# EasyEDA Pro project 贴片练习PCB.epro, schematic Schematic1
Create Date: 2023-04-28; Page Name: P2; Project Name: 贴贴板; Schematic Name: Schematic1; Update Date: 2023-04-28; Company: 嘉立创EDA; Page Size: A4; Version: V1.0
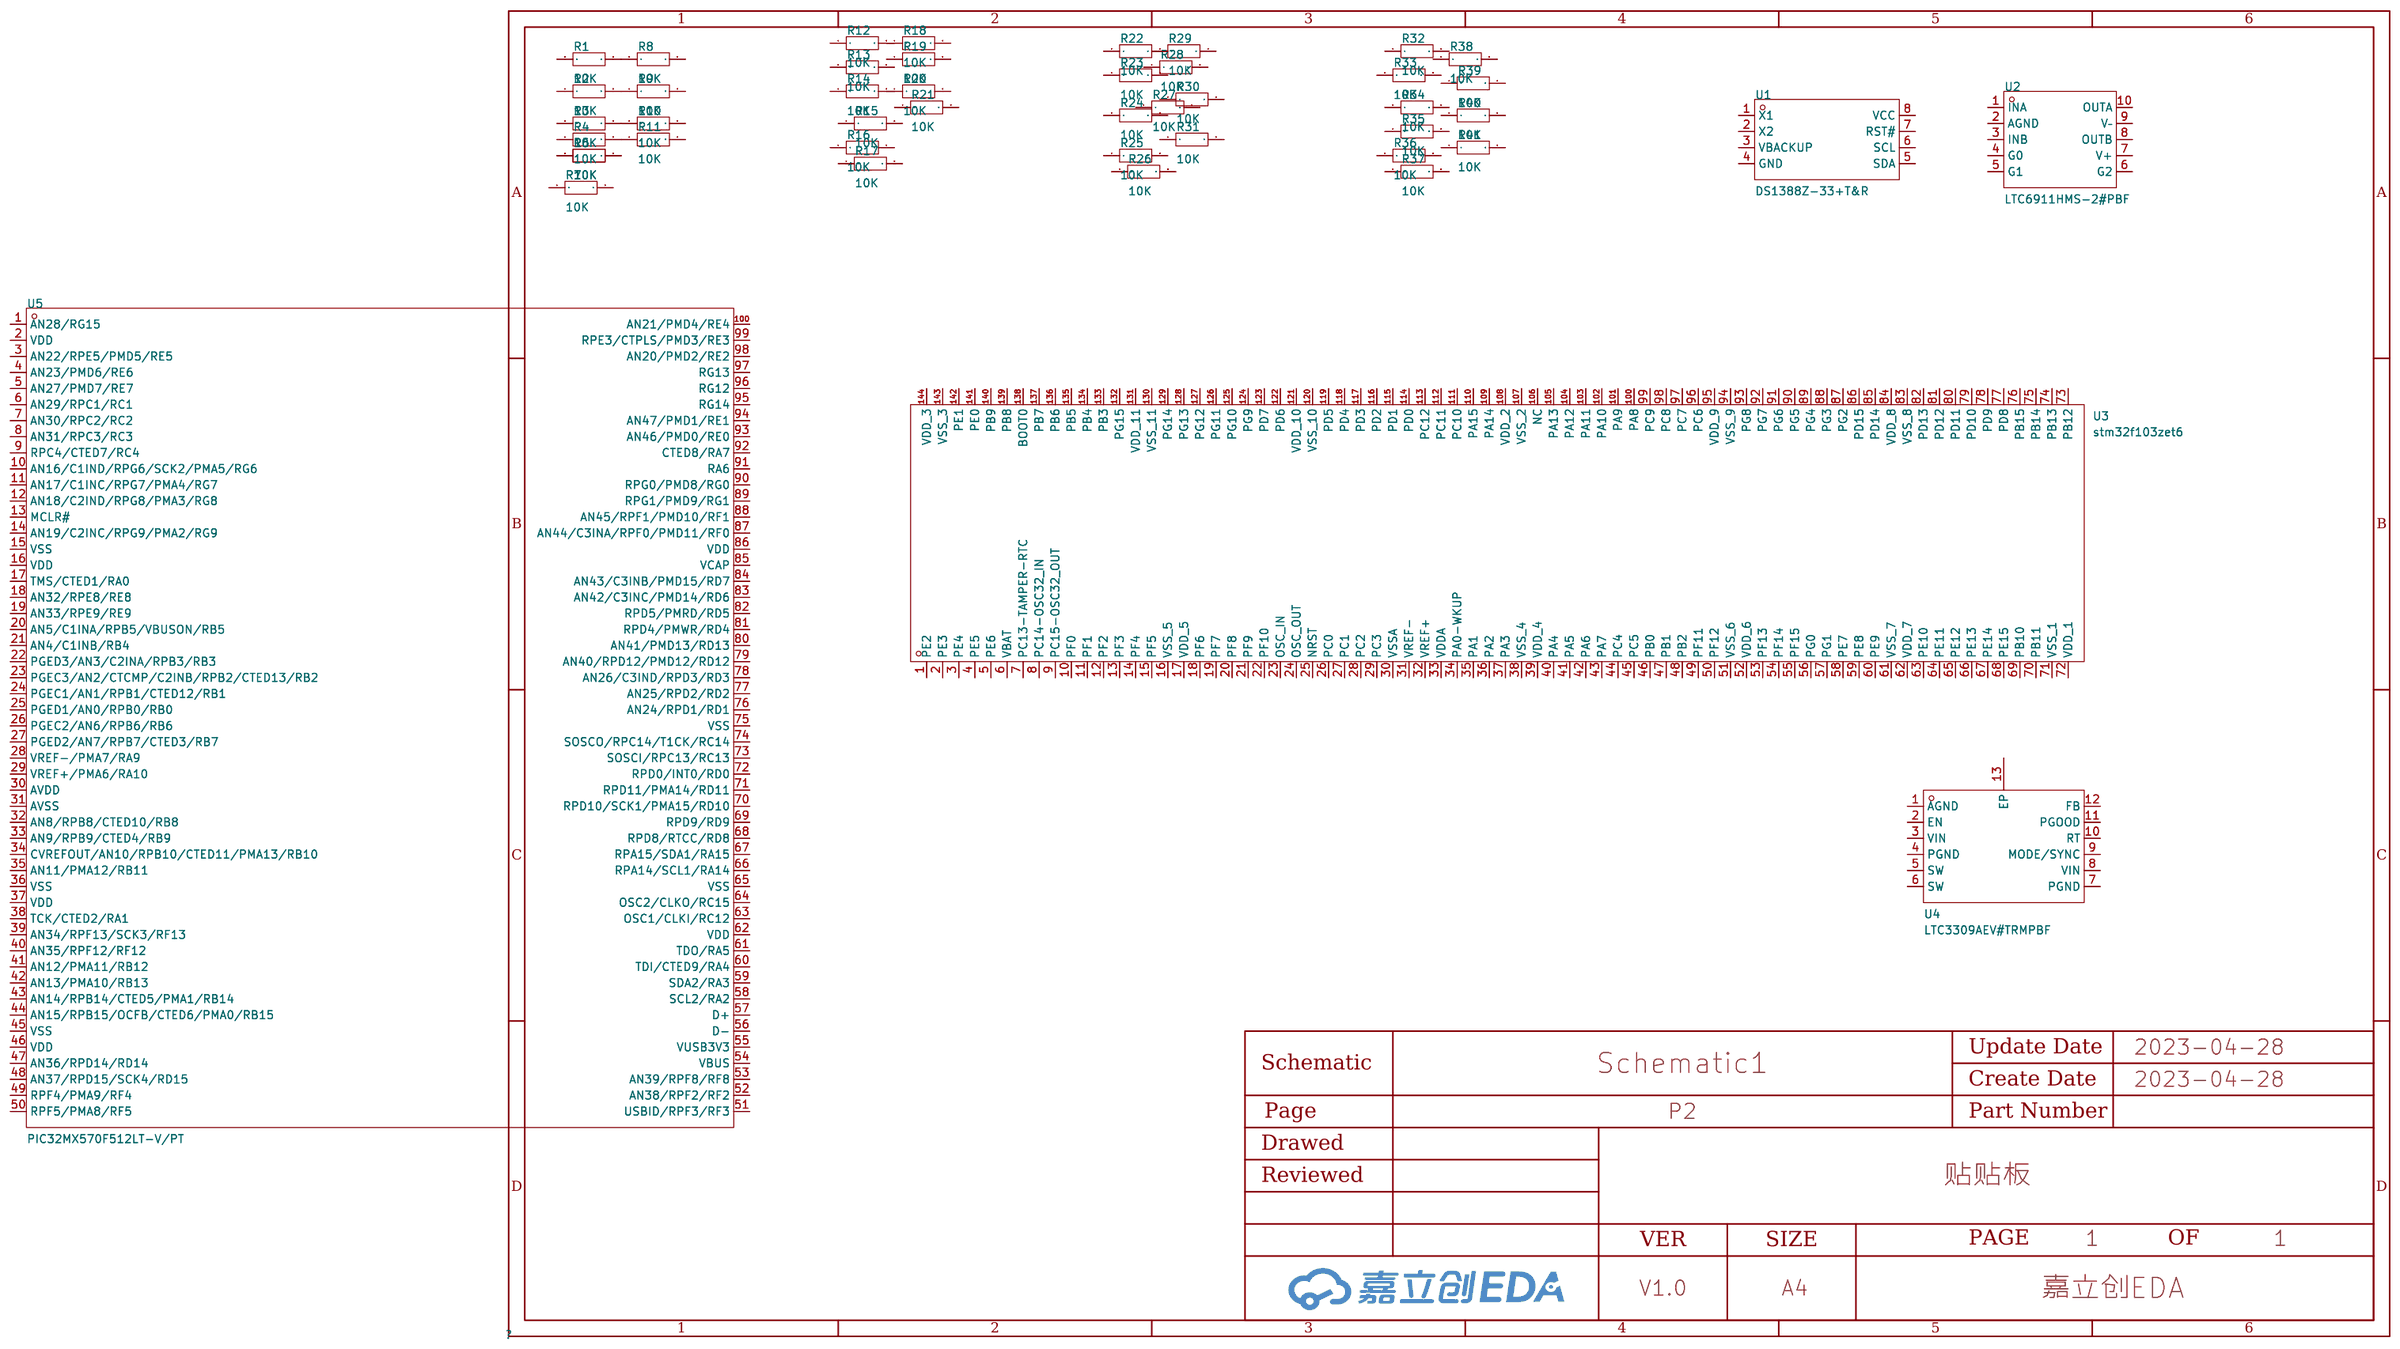
[diagram p0: schematic sheet]

## Parts
R1  10K  [R0201]
R2  10K  [R0201]
R3  10K  [R0201]
R4  10K  [R0201]
R5  10K  [R0201]
R6  10K  [R0201]
R7  10K  [R0201]
R8  10K  [R0201]
R9  10K  [R0201]
R10  10K  [R0201]
R11  10K  [R0201]
R12  10K  [R0402]
R13  10K  [R0402]
R14  10K  [R0402]
R15  10K  [R0402]
R16  10K  [R0402]
R17  10K  [R0402]
R18  10K  [R0402]
R19  10K  [R0402]
R20  10K  [R0402]
R21  10K  [R0402]
R22  10K  [R0603]
R23  10K  [R0603]
R24  10K  [R0603]
R25  10K  [R0603]
R26  10K  [R0603]
R27  10K  [R0603]
R28  10K  [R0603]
R29  10K  [R0603]
R30  10K  [R0603]
R31  10K  [R0603]
R32  10K  [R0805]
R33  10K  [R0805]
R34  10K  [R0805]
R35  10K  [R0805]
R36  10K  [R0805]
R37  10K  [R0805]
R38  10K  [R0805]
R39  10K  [R0805]
R40  10K  [R0805]
R41  10K  [R0805]
U1  DS1388Z-33+T&R  [SOIC-8_L4.9-W3.9-P1.27-LS6.0-BL]
U2  LTC6911HMS-2#PBF  [MSOP-10_L3.0-W3.0-P0.50-LS4.9-BL]
U3  stm32f103zet6  [LQFP-144_L20.0-W20.0-P0.50-LS22.0-BL]
U4  LTC3309AEV#TRMPBF  [LQFN-12_L2.0-W2.0-P0.50-TL-EP0.7]
U5  PIC32MX570F512LT-V/PT  [TQFP-100_L12.0-W12.0-P0.40-LS14.0-BL]

## Library data of the parts
R1-R11 = Res_0201: Supplier Footprint: 0201
R12-R21 = Res_0402: Supplier Footprint: 0402
R22-R31 = Res_0603: Supplier Footprint: 0603
R32-R41 = Res_0805: Supplier Footprint: 0805
U1 = DS1388Z-33+T&R: 接口:I2C;; LCSC Part Name: I2C 2.97V~3.63V; Supplier Part: C118483; Manufacturer: ADI(亚德诺)/MAXIM(美信); Supplier Footprint: SOIC-8; JLCPCB Part Class: Extended Part; Datasheet: https://atta.szlcsc.com/upload/public/pdf/source/20170713/C118483_1499918892954816767.pdf; Supplier: LCSC; Interface: I2C; Operating Voltage: 2.97V~3.63V
U2 = LTC6911HMS-2#PBF: 放大器类型:-;通道数:2;-3dB带宽:-;输入偏置电流(Ib):-;压摆率(SR):16V/us;; Supplier Part: C689693; Manufacturer: ADI(亚德诺); Supplier Footprint: MSOP-10; JLCPCB Part Class: Extended Part; Datasheet: https://atta.szlcsc.com/upload/public/pdf/source/20200728/C689697_D29A73EDDD2648B90A1111EA674FAD07.pdf; Supplier: LCSC; Number of Channels: 2; Slew Rate (SR): 16V/us; Supply Current: 3.1mA
U3 = stm32f103zet6_1: Supplier Part: C9900046927; Supplier Footprint: LQFP-100; Supplier: LCSC
U4 = LTC3309AEV#TRMPBF: 功能类型:降压型;同步整流:是;输出类型:可调;输出通道数:1;拓扑结构:降压式;输入电压:2.25V~5.5V;输出电压:500mV~2.25V;输出电流(最大值):6A;开关频率:3MHz;工作温度:-40℃~+125℃@(TJ);; LCSC Part Name: 降压型 Vin=2.25V~5.5V Vout=500mV~2.25V 6A; Supplier Part: C684456; Manufacturer: ADI(亚德诺)/LINEAR(凌特); Supplier Footprint: LQFN-12; JLCPCB Part Class: Extended Part; Datasheet: https://atta.szlcsc.com/upload/public/pdf/source/20200727/C684456_2EC784DF8DBB6B6CF85BFFE81950187B.pdf; Supplier: LCSC; Function: 降压型; Synchronous Rectification: 是; Output Type: 可调; Number of Outputs: 1; Topology: 降压式; Input Voltage: 2.25V~5.5V; Output Voltage: 500mV~2.25V; Output Current (Max): 6A; Switching Frequency: 3MHz; Operating Temperature: -40℃~+125℃@(TJ)
U5 = PIC32MX570F512LT-V/PT: Supplier Part: C631370; Manufacturer: MICROCHIP(美国微芯); Supplier Footprint: TFBGA-100; JLCPCB Part Class: Extended Part; Supplier: LCSC

## Nets
$2N3312: R5.2 R6.2
$2N3314: R5.1 R6.1
$2N3358: R1.2 R8.1
$2N3381: R2.2 R9.1
$2N3404: R3.2 R10.1
$2N3427: R4.2 R11.1

Not connected (* = marked no-connect by the designer): R1 1; R2 1; R3 1; R4 1; R7 1 2; R8 2; R9 2; R10 2; R11 2; R12 1 2; R13 1 2; R14 1 2; R15 1 2; R16 1 2; R17 1 2; R18 1 2; R19 1 2; R20 1 2; R21 1 2; R22 1 2; R23 1 2; R24 1 2; R25 1 2; R26 1 2; R27 1 2; R28 1 2; R29 1 2; R30 1 2; R31 1 2; R32 1 2; R33 1 2; R34 1 2; R35 1 2; R36 1 2; R37 1 2; R38 1 2; R39 1 2; R40 1 2; R41 1 2; U1 1(X1) 2(X2) 3(VBACKUP) 4(GND) 5(SDA) 6(SCL) 7(RST#) 8(VCC); U2 1(INA) 2(AGND) 3(INB) 4(G0) 5(G1) 6(G2) 7(V+) 8(OUTB) 9(V–) 10(OUTA); U3 1(PE2) 2(PE3) 3(PE4) 4(PE5) 5(PE6) 6(VBAT) 7(PC13-TAMPER-RTC) 8(PC14-OSC32_IN) 9(PC15-OSC32_OUT) 10(PF0) 11(PF1) 12(PF2) 13(PF3) 14(PF4) 15(PF5) 16(VSS_5) 17(VDD_5) 18(PF6) 19(PF7) 20(PF8) 21(PF9) 22(PF10) 23(OSC_IN) 24(OSC_OUT) 25(NRST) 26(PC0) 27(PC1) 28(PC2) 29(PC3) 30(VSSA) 31(VREF-) 32(VREF+) 33(VDDA) 34(PA0-WKUP) 35(PA1) 36(PA2) 37(PA3) 38(VSS_4) 39(VDD_4) 40(PA4) 41(PA5) 42(PA6) 43(PA7) 44(PC4) 45(PC5) 46(PB0) 47(PB1) 48(PB2) 49(PF11) 50(PF12) 51(VSS_6) 52(VDD_6) 53(PF13) 54(PF14) 55(PF15) 56(PG0) 57(PG1) 58(PE7) 59(PE8) 60(PE9) 61(VSS_7) 62(VDD_7) 63(PE10) 64(PE11) 65(PE12) 66(PE13) 67(PE14) 68(PE15) 69(PB10) 70(PB11) 71(VSS_1) 72(VDD_1) 73(PB12) 74(PB13) 75(PB14) 76(PB15) 77(PD8) 78(PD9) 79(PD10) 80(PD11) 81(PD12) 82(PD13) 83(VSS_8) 84(VDD_8) 85(PD14) 86(PD15) 87(PG2) 88(PG3) 89(PG4) 90(PG5) 91(PG6) 92(PG7) 93(PG8) 94(VSS_9) 95(VDD_9) 96(PC6) 97(PC7) 98(PC8) 99(PC9) 100(PA8) 101(PA9) 102(PA10) 103(PA11) 104(PA12) 105(PA13) 106(NC) 107(VSS_2) 108(VDD_2) 109(PA14) 110(PA15) 111(PC10) 112(PC11) 113(PC12) 114(PD0) 115(PD1) 116(PD2) 117(PD3) 118(PD4) 119(PD5) 120(VSS_10) 121(VDD_10) 122(PD6) 123(PD7) 124(PG9) 125(PG10) 126(PG11) 127(PG12) 128(PG13) 129(PG14) 130(VSS_11) 131(VDD_11) 132(PG15) 133(PB3) 134(PB4) 135(PB5) 136(PB6) 137(PB7) 138(BOOT0) 139(PB8) 140(PB9) 141(PE0) 142(PE1) 143(VSS_3) 144(VDD_3); U4 1(AGND) 2(EN) 3(VIN) 4(PGND) 5(SW) 6(SW) 7(PGND) 8(VIN) 9(MODE/SYNC) 10(RT) 11(PGOOD) 12(FB) 13(EP); U5 1(AN28/RG15) 2(VDD) 3(AN22/RPE5/PMD5/RE5) 4(AN23/PMD6/RE6) 5(AN27/PMD7/RE7) 6(AN29/RPC1/RC1) 7(AN30/RPC2/RC2) 8(AN31/RPC3/RC3) 9(RPC4/CTED7/RC4) 10(AN16/C1IND/RPG6/SCK2/PMA5/RG6) 11(AN17/C1INC/RPG7/PMA4/RG7) 12(AN18/C2IND/RPG8/PMA3/RG8) 13(MCLR#) 14(AN19/C2INC/RPG9/PMA2/RG9) 15(VSS) 16(VDD) 17(TMS/CTED1/RA0) 18(AN32/RPE8/RE8) 19(AN33/RPE9/RE9) 20(AN5/C1INA/RPB5/VBUSON/RB5) 21(AN4/C1INB/RB4) 22(PGED3/AN3/C2INA/RPB3/RB3) 23(PGEC3/AN2/CTCMP/C2INB/RPB2/CTED13/RB2) 24(PGEC1/AN1/RPB1/CTED12/RB1) 25(PGED1/AN0/RPB0/RB0) 26(PGEC2/AN6/RPB6/RB6) 27(PGED2/AN7/RPB7/CTED3/RB7) 28(VREF-/PMA7/RA9) 29(VREF+/PMA6/RA10) 30(AVDD) 31(AVSS) 32(AN8/RPB8/CTED10/RB8) 33(AN9/RPB9/CTED4/RB9) 34(CVREFOUT/AN10/RPB10/CTED11/PMA13/RB10) 35(AN11/PMA12/RB11) 36(VSS) 37(VDD) 38(TCK/CTED2/RA1) 39(AN34/RPF13/SCK3/RF13) 40(AN35/RPF12/RF12) 41(AN12/PMA11/RB12) 42(AN13/PMA10/RB13) 43(AN14/RPB14/CTED5/PMA1/RB14) 44(AN15/RPB15/OCFB/CTED6/PMA0/RB15) 45(VSS) 46(VDD) 47(AN36/RPD14/RD14) 48(AN37/RPD15/SCK4/RD15) 49(RPF4/PMA9/RF4) 50(RPF5/PMA8/RF5) 51(USBID/RPF3/RF3) 52(AN38/RPF2/RF2) 53(AN39/RPF8/RF8) 54(VBUS) 55(VUSB3V3) 56(D-) 57(D+) 58(SCL2/RA2) 59(SDA2/RA3) 60(TDI/CTED9/RA4) 61(TDO/RA5) 62(VDD) 63(OSC1/CLKI/RC12) 64(OSC2/CLKO/RC15) 65(VSS) 66(RPA14/SCL1/RA14) 67(RPA15/SDA1/RA15) 68(RPD8/RTCC/RD8) 69(RPD9/RD9) 70(RPD10/SCK1/PMA15/RD10) 71(RPD11/PMA14/RD11) 72(RPD0/INT0/RD0) 73(SOSCI/RPC13/RC13) 74(SOSCO/RPC14/T1CK/RC14) 75(VSS) 76(AN24/RPD1/RD1) 77(AN25/RPD2/RD2) 78(AN26/C3IND/RPD3/RD3) 79(AN40/RPD12/PMD12/RD12) 80(AN41/PMD13/RD13) 81(RPD4/PMWR/RD4) 82(RPD5/PMRD/RD5) 83(AN42/C3INC/PMD14/RD6) 84(AN43/C3INB/PMD15/RD7) 85(VCAP) 86(VDD) 87(AN44/C3INA/RPF0/PMD11/RF0) 88(AN45/RPF1/PMD10/RF1) 89(RPG1/PMD9/RG1) 90(RPG0/PMD8/RG0) 91(RA6) 92(CTED8/RA7) 93(AN46/PMD0/RE0) 94(AN47/PMD1/RE1) 95(RG14) 96(RG12) 97(RG13) 98(AN20/PMD2/RE2) 99(RPE3/CTPLS/PMD3/RE3) 100(AN21/PMD4/RE4)
